# Altium schematic sheet MCU.SchDoc
size A4; SheetNumber: 2; SheetTotal: 2
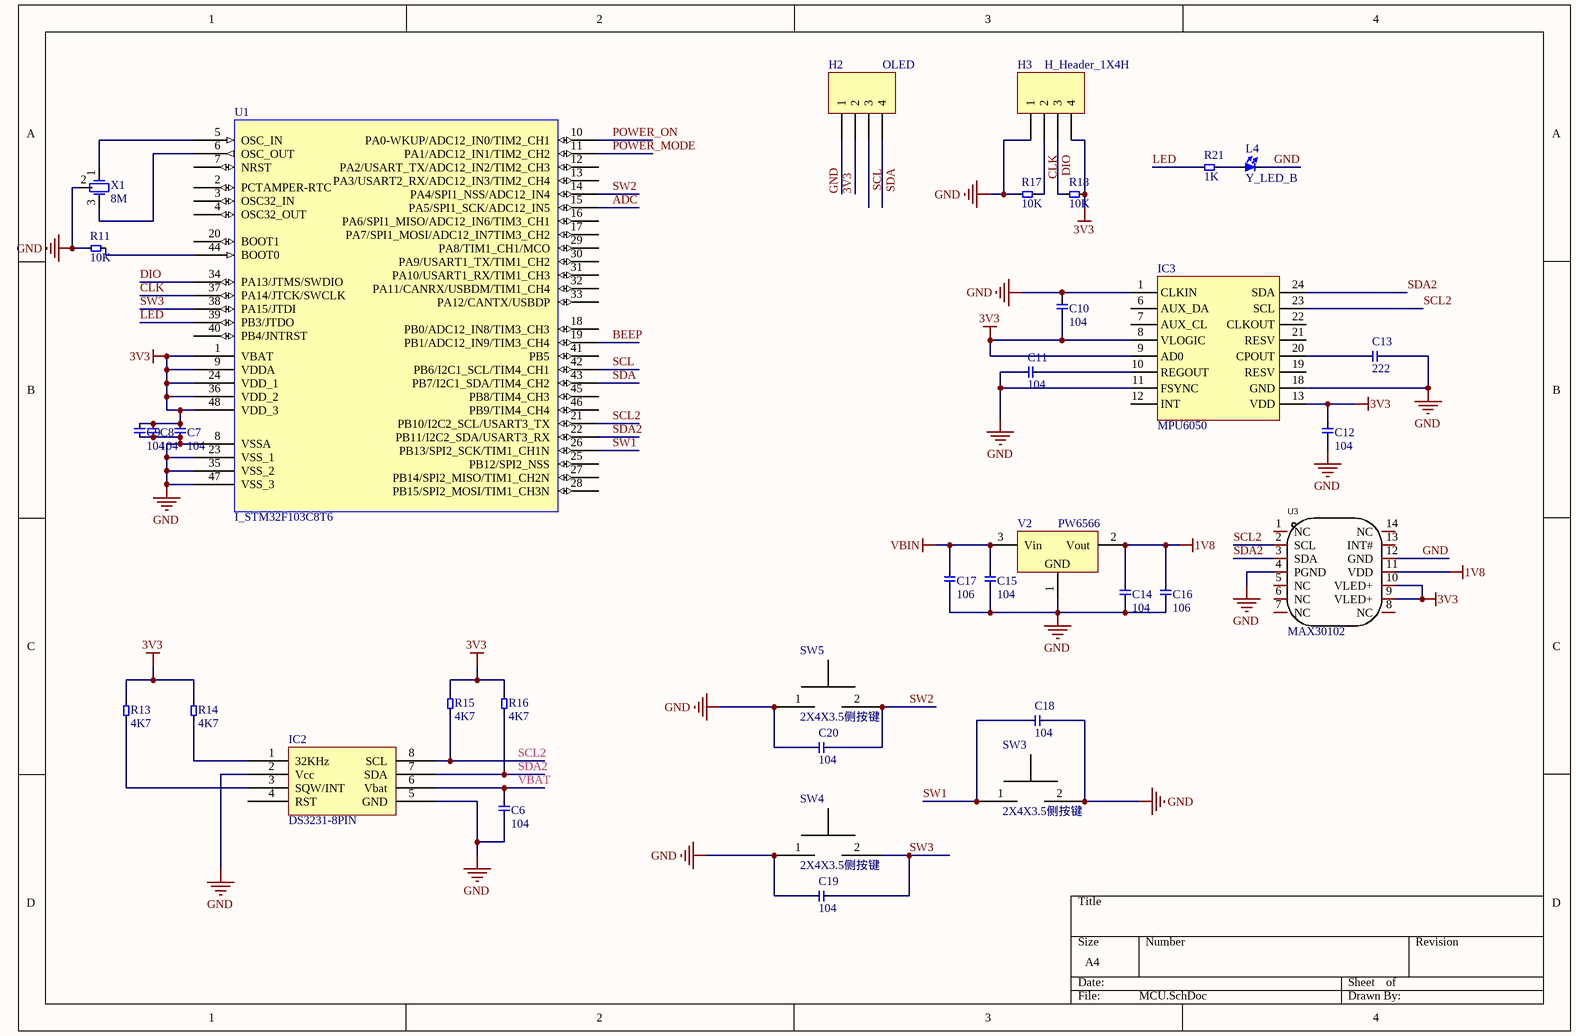
[diagram p0: MCU.SchDoc]

## Parts
C6  104  [C_0603]
C7  104  [C_0603]
C8  104  [C_0603]
C9  104  [C_0603]
C10  104  [C_0603]
C11  104  [C_0603]
C12  104  [C_0603]
C13  222  [C_0603]
C14  104  [C_0603]
C15  104  [C_0603]
C16  106  [C_0603]
C17  106  [C_0603]
C18  104  [C_0603]
C19  104  [C_0603]
C20  104  [C_0603]
H2  OLED  [H_Header_1X4]
H3  H_Header_1X4H  [H_Header_1X4]
IC2  DS3231-8PIN  [SOP8_N]
IC3  MPU6050  [QFN24 4x4_M]
L4  Y_LED_B  [Y_LED_0603_B]
R11  10K  [R_0603]
R13  4K7  [R_0603]
R14  4K7  [R_0603]
R15  4K7  [R_0603]
R16  4K7  [R_0603]
R17  10K  [R_0603]
R18  10K  [R_0603]
R21  1K  [R_0603]
SW3  2X4X3.5侧按键  [2X4X3.5贴片侧按开关]
SW4  2X4X3.5侧按键  [2X4X3.5贴片侧按开关]
SW5  2X4X3.5侧按键  [2X4X3.5贴片侧按开关]
U1  I_STM32F103C8T6  [I_LQFP-48]
U3  MAX30102  [OESIP-14_L5.6-W3.3-P0.80-TL]
V2  PW6566  [SOT23-3N]
X1  8M  [XTAL-3.2*1.3MM]

## Nets
1V8: C14.2 C16.2 U3.11(VDD) V2.2(Vout)
3V3: C7.2 C8.2 C9.2 C10.1 C12.1 H2.2 H3.4 IC3.8(VLOGIC) IC3.9(AD0) IC3.13(VDD) R13.2 R14.2 R15.2 R16.2 R18.2 U1.1(VBAT) U1.9(VDDA) U1.24(VDD_1) U1.36(VDD_2) U1.48(VDD_3) U3.9(VLED+) U3.10(VLED+)
GND: C6.1 C7.1 C8.1 C9.1 C10.2 C11.2 C12.2 C13.2 C14.1 C15.1 C16.1 C17.1 C18.2 C19.1 C20.1 H2.1 H3.1 IC2.2(Vcc) IC2.5(GND) IC3.1(CLKIN) IC3.11(FSYNC) IC3.18(GND) L4.2 R11.1 R17.1 SW3.2 SW4.1 SW5.1 U1.8(VSSA) U1.23(VSS_1) U1.35(VSS_2) U1.47(VSS_3) U3.4(PGND) U3.12(GND) V2.1(GND) X1.2
VBIN: C15.2 C17.2 V2.3(Vin)
ADC: U1.15(PA5/SPI1_SCK/ADC12_IN5)
BEEP: U1.19(PB1/ADC12_IN9/TIM3_CH4)
CLK: H3.2 R17.2 U1.37(PA14/JTCK/SWCLK)
DIO: H3.3 R18.1 U1.34(PA13/JTMS/SWDIO)
LED: R21.2 U1.39(PB3/JTDO)
POWER_MODE: U1.11(PA1/ADC12_IN1/TIM2_CH2)
POWER_ON: U1.10(PA0-WKUP/ADC12_IN0/TIM2_CH1)
SCL: H2.3 U1.42(PB6/I2C1_SCL/TIM4_CH1)
SCL2: IC2.8(SCL) IC3.23(SCL) R15.1 U1.21(PB10/I2C2_SCL/USART3_TX) U3.2(SCL)
SDA: H2.4 U1.43(PB7/I2C1_SDA/TIM4_CH2)
SDA2: IC2.7(SDA) IC3.24(SDA) R16.1 U1.22(PB11/I2C2_SDA/USART3_RX) U3.3(SDA)
SW1: C18.1 SW3.1 U1.26(PB13/SPI2_SCK/TIM1_CH1N)
SW2: C20.2 SW5.2 U1.14(PA4/SPI1_NSS/ADC12_IN4)
SW3: C19.2 SW4.2 U1.38(PA15/JTDI)
VBAT: C6.2 IC2.6(Vbat)
NetC11_1: C11.1 IC3.10(REGOUT)
NetC13_1: C13.1 IC3.20(CPOUT)
NetIC2_1: IC2.1(32KHz) R14.1
NetIC2_3: IC2.3(SQW/INT) R13.1
NetL4_1: L4.1 R21.1
NetR11_2: R11.2 U1.44(BOOT0)
NetU1_5: U1.5(OSC_IN) X1.1(OSC1)
NetU1_6: U1.6(OSC_OUT) X1.3

Not connected (* = marked no-connect by the designer): IC2 4(RST); IC3 6(AUX_DA) 7(AUX_CL) 12(INT) 19(RESV) 21(RESV) 22(CLKOUT); U1 2(PCTAMPER-RTC) 3(OSC32_IN) 4(OSC32_OUT) 7(NRST) 12(PA2/USART_TX/ADC12_IN2/TIM2_CH3) 13(PA3/USART2_RX/ADC12_IN3/TIM2_CH4) 16(PA6/SPI1_MISO/ADC12_IN6/TIM3_CH1) 17(PA7/SPI1_MOSI/ADC12_IN7TIM3_CH2) 18(PB0/ADC12_IN8/TIM3_CH3) 20(BOOT1) 25(PB12/SPI2_NSS) 27(PB14/SPI2_MISO/TIM1_CH2N) 28(PB15/SPI2_MOSI/TIM1_CH3N) 29(PA8/TIM1_CH1/MCO) 30(PA9/USART1_TX/TIM1_CH2) 31(PA10/USART1_RX/TIM1_CH3) 32(PA11/CANRX/USBDM/TIM1_CH4) 33(PA12/CANTX/USBDP) 40(PB4/JNTRST) 41(PB5) 45(PB8/TIM4_CH3) 46(PB9/TIM4_CH4); U3 1(NC) 5(NC) 6(NC) 7(NC) 8(NC) 13(INT#) 14(NC)

## Library data of the parts
C6-C20 = C_无极贴片: 无极性贴片电容
H2 H3 = H_Header_1X4H: 单排4针排母; LatestRevisionDate: 17-Jul-2002; LatestRevisionNote: Re-released for DXP Platform.; Publisher: Altium Limited
IC3 = MPU6050: 陀螺仪
L4 = Y_LED_B: 蓝色LED
R11 R13-R18 R21 = R_贴片: 贴片电阻
U1 = I_STM32F103C8T6: LQFP-48
U3 = MAX30101EFD+T: Manufacturer: MAXIM(美信); Add into BOM: yes; Name: MAX30101EFD+T; Symbol: MAX30101EFD+T; Device: MAX30101EFD+T; LCSC Part Name: MAX30101EFD+T; Supplier Part: C2859066; Manufacturer Part: MAX30101EFD+T; Supplier Footprint: OESIP-14; JLCPCB Part Class: Extended Part; Datasheet: https://atta.szlcsc.com/upload/public/pdf/source/20221219/A83A6B2BE3828C2A438FF2EEAED7B281.pdf; Supplier: LCSC; Convert to PCB: yes
V2 = XC6206P332MR: 低压差线性稳压芯片; 版权归属: 源创客; BOM名称: 低压差线性稳压芯片; 学习资源: www.ooocke.com
X1 = XTAL-3213-3P: 8~20M-3.2*1.3mm-3P